# EAGLE design VIDCEnhancer (EAGLE 6.2)
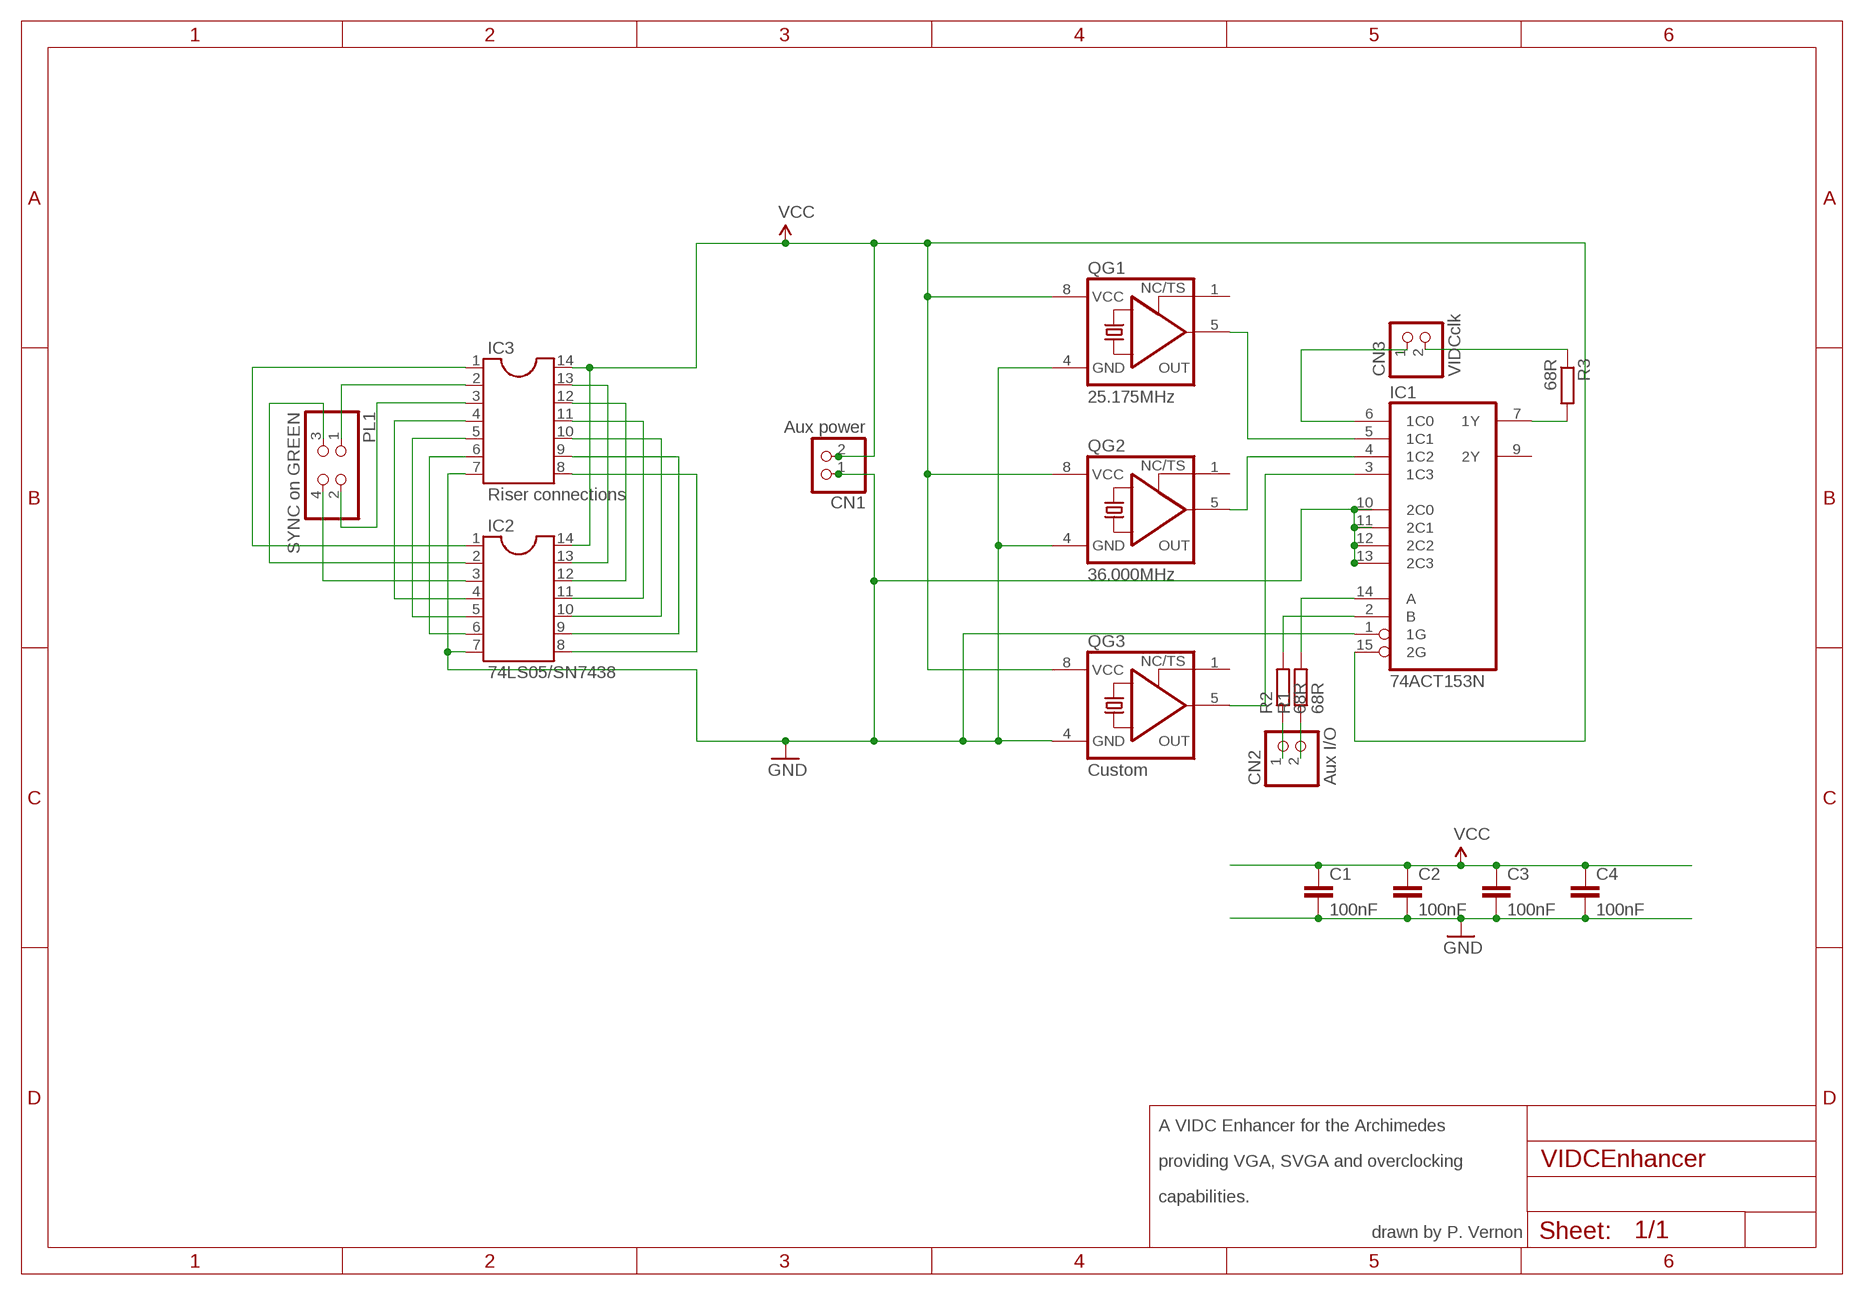
[diagram p0: schematic, sheet 1]

## Parts
C1  100nF  C-EU025-025X050  [C025-025X050]
C2  100nF  C-EU025-025X050  [C025-025X050]
C3  100nF  C-EU025-025X050  [C025-025X050]
C4  100nF  C-EU025-025X050  [C025-025X050]
CN1  Aux power  PINHD-1X2/90  [1X02/90]
CN2  Aux I/O  PINHD-1X2/90  [1X02/90]
CN3  VIDCclk  PINHD-1X2/90  [1X02/90]
IC1  74ACT153N  [DIL16]
IC2  74LS05/SN7438  DIL14S  [SOCKET-14]
IC3  Riser connections  DIL14S  [SOCKET-14]
PL1  SYNC on GREEN  PINHD-2X2  [2X02]
QG1  25.175MHz  XO-8  [DIL08S]
QG2  36.000MHz  XO-8  [DIL08S]
QG3  Custom  XO-8  [DIL08S]
R1  68R  R-EU_0207/10  [0207/10]
R2  68R  R-EU_0207/10  [0207/10]
R3  68R  R-EU_0207/10  [0207/10]

## Nets
GND: C1.2 C2.2 C3.2 C4.2 CN1.1 IC1.1(1G) IC1.10(2C0) IC1.11(2C1) IC1.12(2C2) IC1.13(2C3) IC2.7 IC3.7 QG1.4(GND) QG2.4(GND) QG3.4(GND)
N$1: IC1.5(1C1) QG1.5(OUT)
N$2: IC1.4(1C2) QG2.5(OUT)
N$3: IC1.3(1C3) QG3.5(OUT)
N$4: IC1.7(1Y) R3.2
N$5: CN3.1 IC1.6(1C0)
N$6: CN2.2 R1.1
N$7: CN2.1 R2.1
N$8: IC2.3 PL1.4
N$9: IC1.2(B) R2.2
N$10: IC1.14(A) R1.2
N$11: CN3.2 R3.1
N$12: IC2.6 IC3.6
N$13: IC2.5 IC3.5
N$14: IC2.4 IC3.4
N$15: IC3.3 PL1.2
N$16: IC3.2 PL1.1
N$17: IC2.1 IC3.1
N$18: IC2.13 IC3.13
N$19: IC2.12 IC3.12
N$20: IC2.11 IC3.11
N$21: IC2.10 IC3.10
N$22: IC2.9 IC3.9
N$23: IC2.8 IC3.8
N$25: IC2.2 PL1.3
VCC: C1.1 C2.1 C3.1 C4.1 CN1.2 IC1.15(2G) IC2.14 IC3.14 QG1.8(VCC) QG2.8(VCC) QG3.8(VCC)
Unconnected: IC1.9(2Y) QG1.1(TS) QG2.1(TS) QG3.1(TS)

## Notes on the sheet
- A VIDC Enhancer for the Archimedes
- providing VGA, SVGA and overclocking
- capabilities.
- drawn by P. Vernon

## Power pins joined to a net without a drawn wire
GND: IC1.8(GND)
VCC: IC1.16(VCC)

## Library data of the parts
C1-C4 = rcl:C-EU: CAPACITOR, European symbol
CN1-CN3 = pinhead:PINHD-1X2: PIN HEADER
IC1 = 74xx-eu:74*153: Dual 4-line to 1-line data SELECTOR/MULTIPLEXER
IC2 IC3 = ic-package:DIL14: Dual In Line / Socket
PL1 = pinhead:PINHD-2X2: PIN HEADER
QG1-QG3 = crystal:XO-: CRYSTAL; OC_FARNELL: unknown; OC_NEWARK: unknown
R1-R3 = resistor:R-EU_: RESISTOR, European symbol

## Board
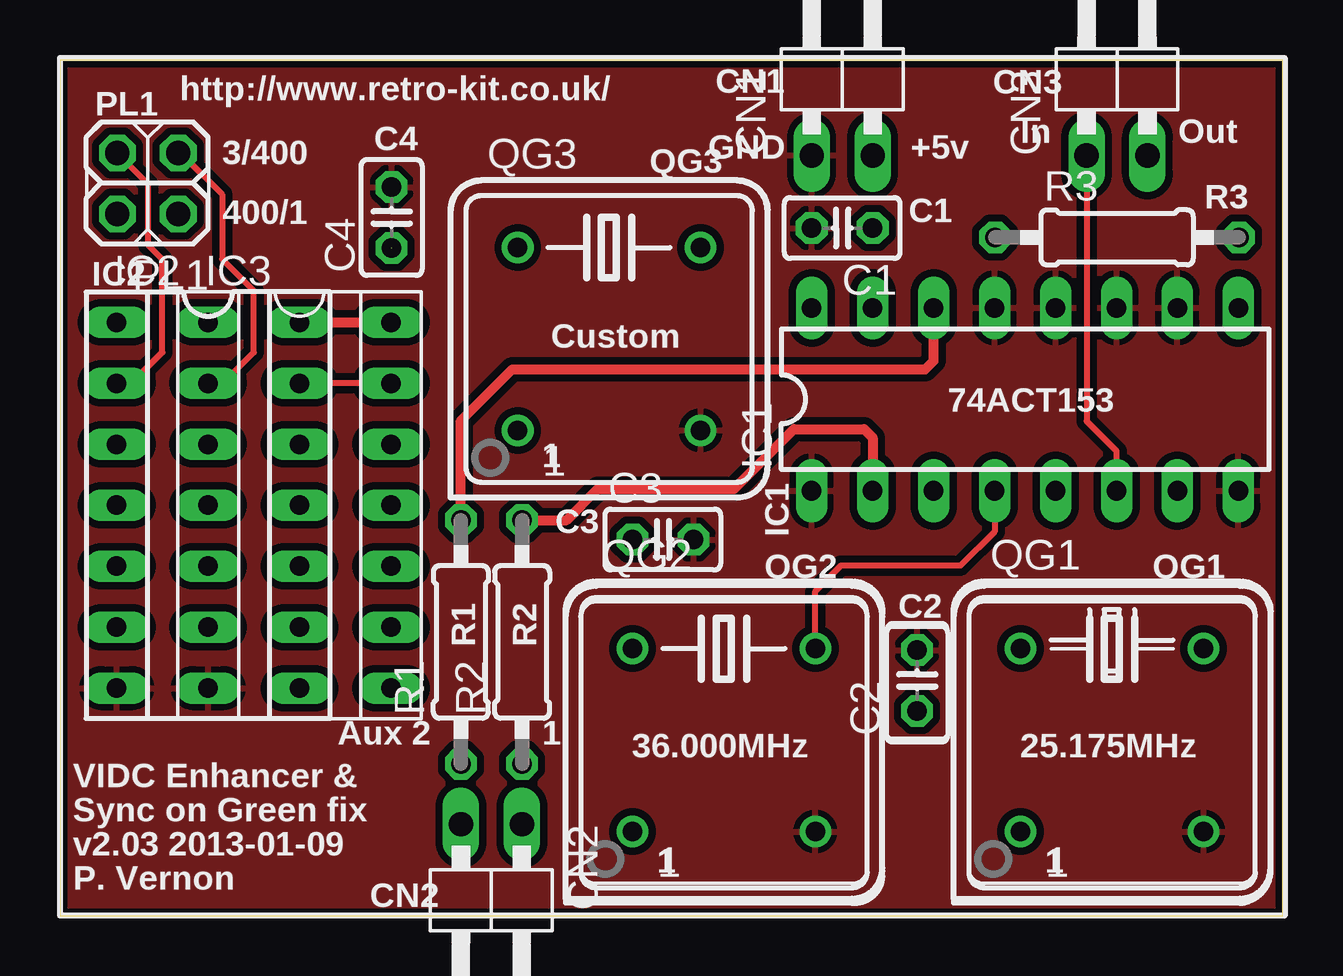
[diagram p1: board, top side]
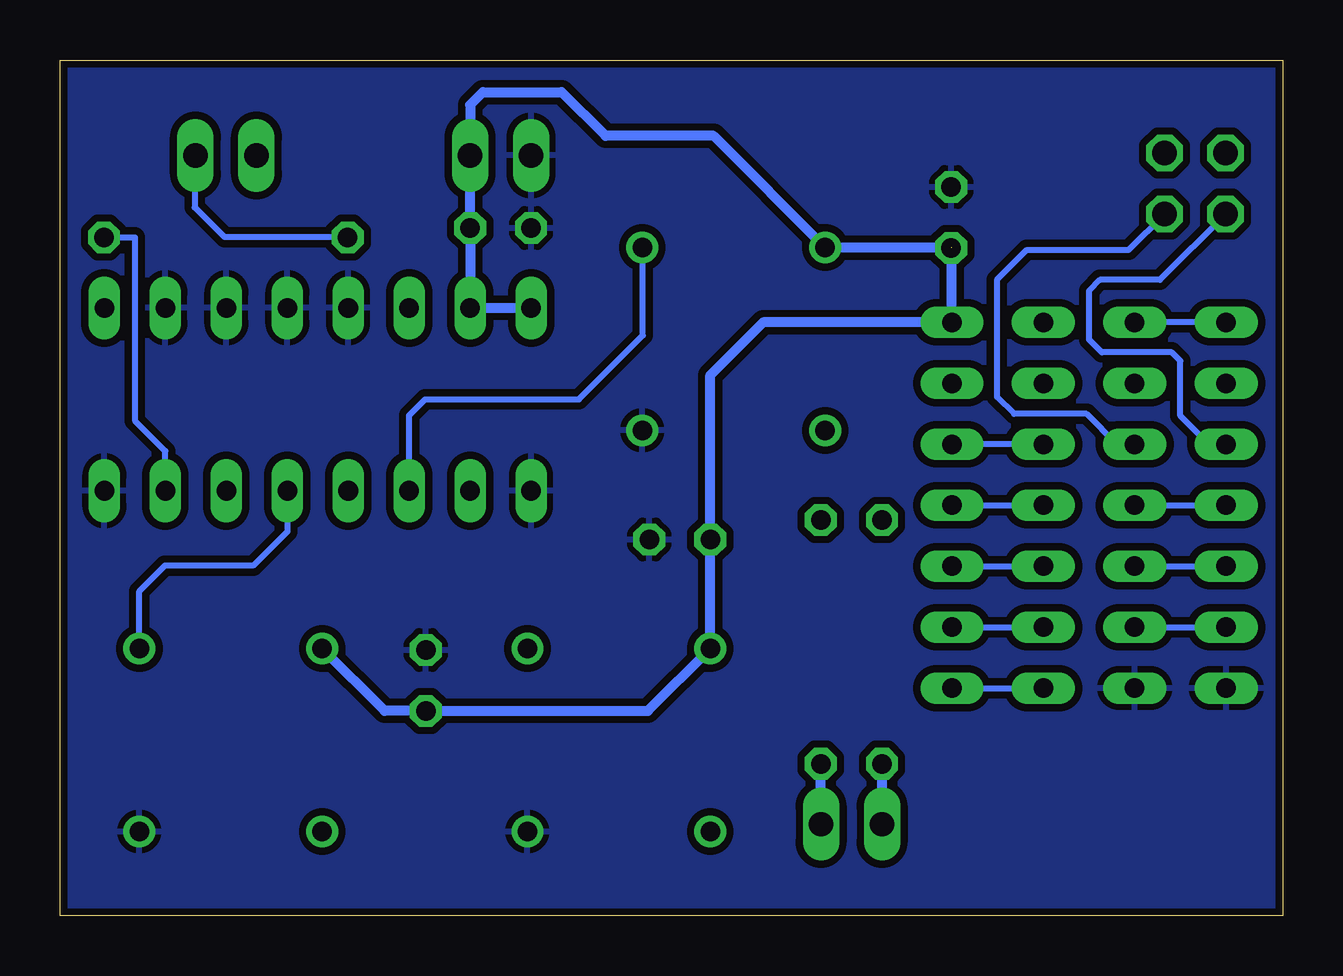
[diagram p2: board, bottom side, seen from below]

Size 50.95 x 35.65 mm. Coordinates in mm from the lower left corner, seen from the top.
Outline: 0,0 50.95,0 50.95,35.65 0,35.65 0,0
Copper layers (1*16): Top 0.035mm / dielectric 1.5mm / Bottom 0.035mm
Design rules: minimum track width 10mil, minimum drill 24mil, track to track 8mil, track to pad 8mil, pad to pad 8mil, via to via 8mil, smd to smd 8mil, copper to edge 10mil, drill to drill 8mil, minimum pad ring 10mil, minimum via ring 8mil, stop-mask expansion 4mil, vias tented up to drill 0mil, thermal gap 10mil

### Footprints (pad centres in the part's own frame; a part is rotated, then mirrored left to right if it is on the bottom)
C025-025X050 = drill 0.813 octagon: 1 -1.27,0; 2 1.27,0
1X02/90 = drill 1.016 long: 1 -1.27,-3.81; 2 1.27,-3.81
DIL16 = drill 0.813 long: 1 -8.89,-3.81; 2 -6.35,-3.81; 3 -3.81,-3.81; 4 -1.27,-3.81; 5 1.27,-3.81; 6 3.81,-3.81; 7 6.35,-3.81; 8 8.89,-3.81; 9 8.89,3.81; 10 6.35,3.81; 11 3.81,3.81; 12 1.27,3.81; 13 -1.27,3.81; 14 -3.81,3.81; 15 -6.35,3.81; 16 -8.89,3.81
SOCKET-14 = drill 0.813 long: 1 -7.62,-3.81; 2 -5.08,-3.81; 3 -2.54,-3.81; 4 0,-3.81; 5 2.54,-3.81; 6 5.08,-3.81; 7 7.62,-3.81; 8 7.62,3.81; 9 5.08,3.81; 10 2.54,3.81; 11 0,3.81; 12 -2.54,3.81; 13 -5.08,3.81; 14 -7.62,3.81
2X02 = drill 1.016 octagon: 1 -1.27,-1.27; 2 -1.27,1.27; 3 1.27,-1.27; 4 1.27,1.27
DIL08S = drill 0.813: 1 -3.81,-3.81; 4 3.81,-3.81; 5 3.81,3.81; 8 -3.81,3.81
0207/10 = drill 0.813 octagon: 1 -5.08,0; 2 5.08,0

### Placement (x,y rotation side)
C1  32.59,28.65 180 top
C2  35.71,9.8 90 top
C3  25.13,15.67 0 top
C4  13.82,29.09 90 top
CN1  32.59,35.48 0 top
CN2  17.97,0 180 top
CN3  44.04,35.48 0 top
IC1  40.21,21.51 0 top
IC2  6.17,17.1 270 top
IC3  9.98,17.1 270 top
PL1  3.66,30.5 180 top
QG1  43.84,7.32 0 top
QG2  27.67,7.32 0 top
QG3  22.88,24.03 0 top
R1  16.7,11.4 90 top
R2  19.25,11.4 90 top
R3  44.04,28.26 0 top

### Tracks (layer width: path | path; a pad name or v marks a point on that pad's centre or on a via)
GND
  pour Bottom (isolate 0.305): 0,35.56 51.03,35.56 51.03,0 0,0
  pour Top (isolate 0.305): 0,35.56 51.03,35.56 51.03,0 0,0
N$1
  Bottom 0.254: IC1.5 41.48,16 42.91,14.58 46.58,14.58 47.65,13.52 QG1.5
N$2
  Top 0.254: IC1.4 38.94,16 37.52,14.58 32.54,14.58 31.48,13.52 QG2.5
N$3
  Bottom 0.254: IC1.3 36.4,20.85 35.74,21.51 29.34,21.51 26.67,24.18 26.67,27.73 QG3.5
N$4
  Bottom 0.254: IC1.7 46.56,19.36 47.83,20.62 47.83,28.26 R3.2
N$5
  Top 0.254: IC1.6 44.02,19.36 42.77,20.61 CN3.1
N$6
  Bottom 0.406: R1.1 CN2.2
N$7
  Bottom 0.406: CN2.1 R2.1
N$8
  Bottom 0.254: PL1.4 5.13,26.49 7.62,26.49 8.08,26.04 8.08,24 7.54,23.47 4.62,23.47 4.27,23.11 4.27,20.83 3.08,19.64 IC2.3
N$9
  Top 0.406: R2.2 21.11,16.48 22.4,17.78 28.09,17.78 30.58,20.27 33.51,20.27 33.86,19.91 IC1.2
N$10
  Top 0.406: IC1.14 36.4,23.11 36.05,22.76 18.85,22.76 16.7,20.61 R1.2
N$11
  Bottom 0.254: CN3.2 45.34,31.65 45.34,29.52 44.09,28.27 38.98,28.27 R3.1
N$12
  Bottom 0.254: IC3.6 IC2.6
N$13
  Bottom 0.254: IC3.5 IC2.5
N$14
  Bottom 0.254: IC3.4 IC2.4
N$15
  Bottom 0.254: PL1.2 6.42,27.74 10.67,27.74 11.91,26.49 11.91,21.61 11.2,20.9 8.18,20.9 6.92,19.64 IC3.3
N$16
  Top 0.254: PL1.1 5.03,31.77 6.76,30.05 6.76,27.36 8.08,26.04 8.08,23.47 6.79,22.18 IC3.2
N$17
  Bottom 0.254: IC2.1 IC3.1
N$18
  Top 0.254: IC3.13 IC2.13
N$19
  Bottom 0.254: IC2.12 IC3.12
N$20
  Bottom 0.254: IC3.11 IC2.11
N$21
  Bottom 0.254: IC3.10 IC2.10
N$22
  Bottom 0.254: IC3.9 IC2.9
N$23
  Bottom 0.254: IC3.8 IC2.8
N$25
  Top 0.254: IC2.2 2.98,22.18 4.27,23.47 4.27,27.36 3.68,27.94 3.68,30.48 PL1.3
VCC  (1 unrouted)
  Top 0.406: IC2.14 IC3.14
  Bottom 0.406: IC1.16 IC1.15 C1.1 CN1.2 33.86,33.78 33.33,34.31 30.05,34.31 28.22,32.49 23.72,32.49 QG3.8 13.79,27.84 IC3.14 21.66,24.72 23.86,22.52 C3.1 QG2.8 26.45,8.53 C2.1 37.43,8.53 QG1.8

### Text on the board
_tsilk: CN1 | CN3 | http://www.retro-kit.co.uk/ | PL1 | GND | +5v | C4 | In | Out | 3/400 | QG3 | 400/1 | C1 | R3 | IC2 | Custom | 74ACT153 | 1 | IC1 | C3 | QG2 | QG1 | C2 | R1 | R2 | Aux 2 | 1 | 36.000MHz | 25.175MHz | VIDC Enhancer & | Sync on Green fix | v2.03 2013-01-09 | 1 | 1 | P. Vernon | CN2